# EAGLE design wtw-v01-00 (EAGLE 7.4.0)
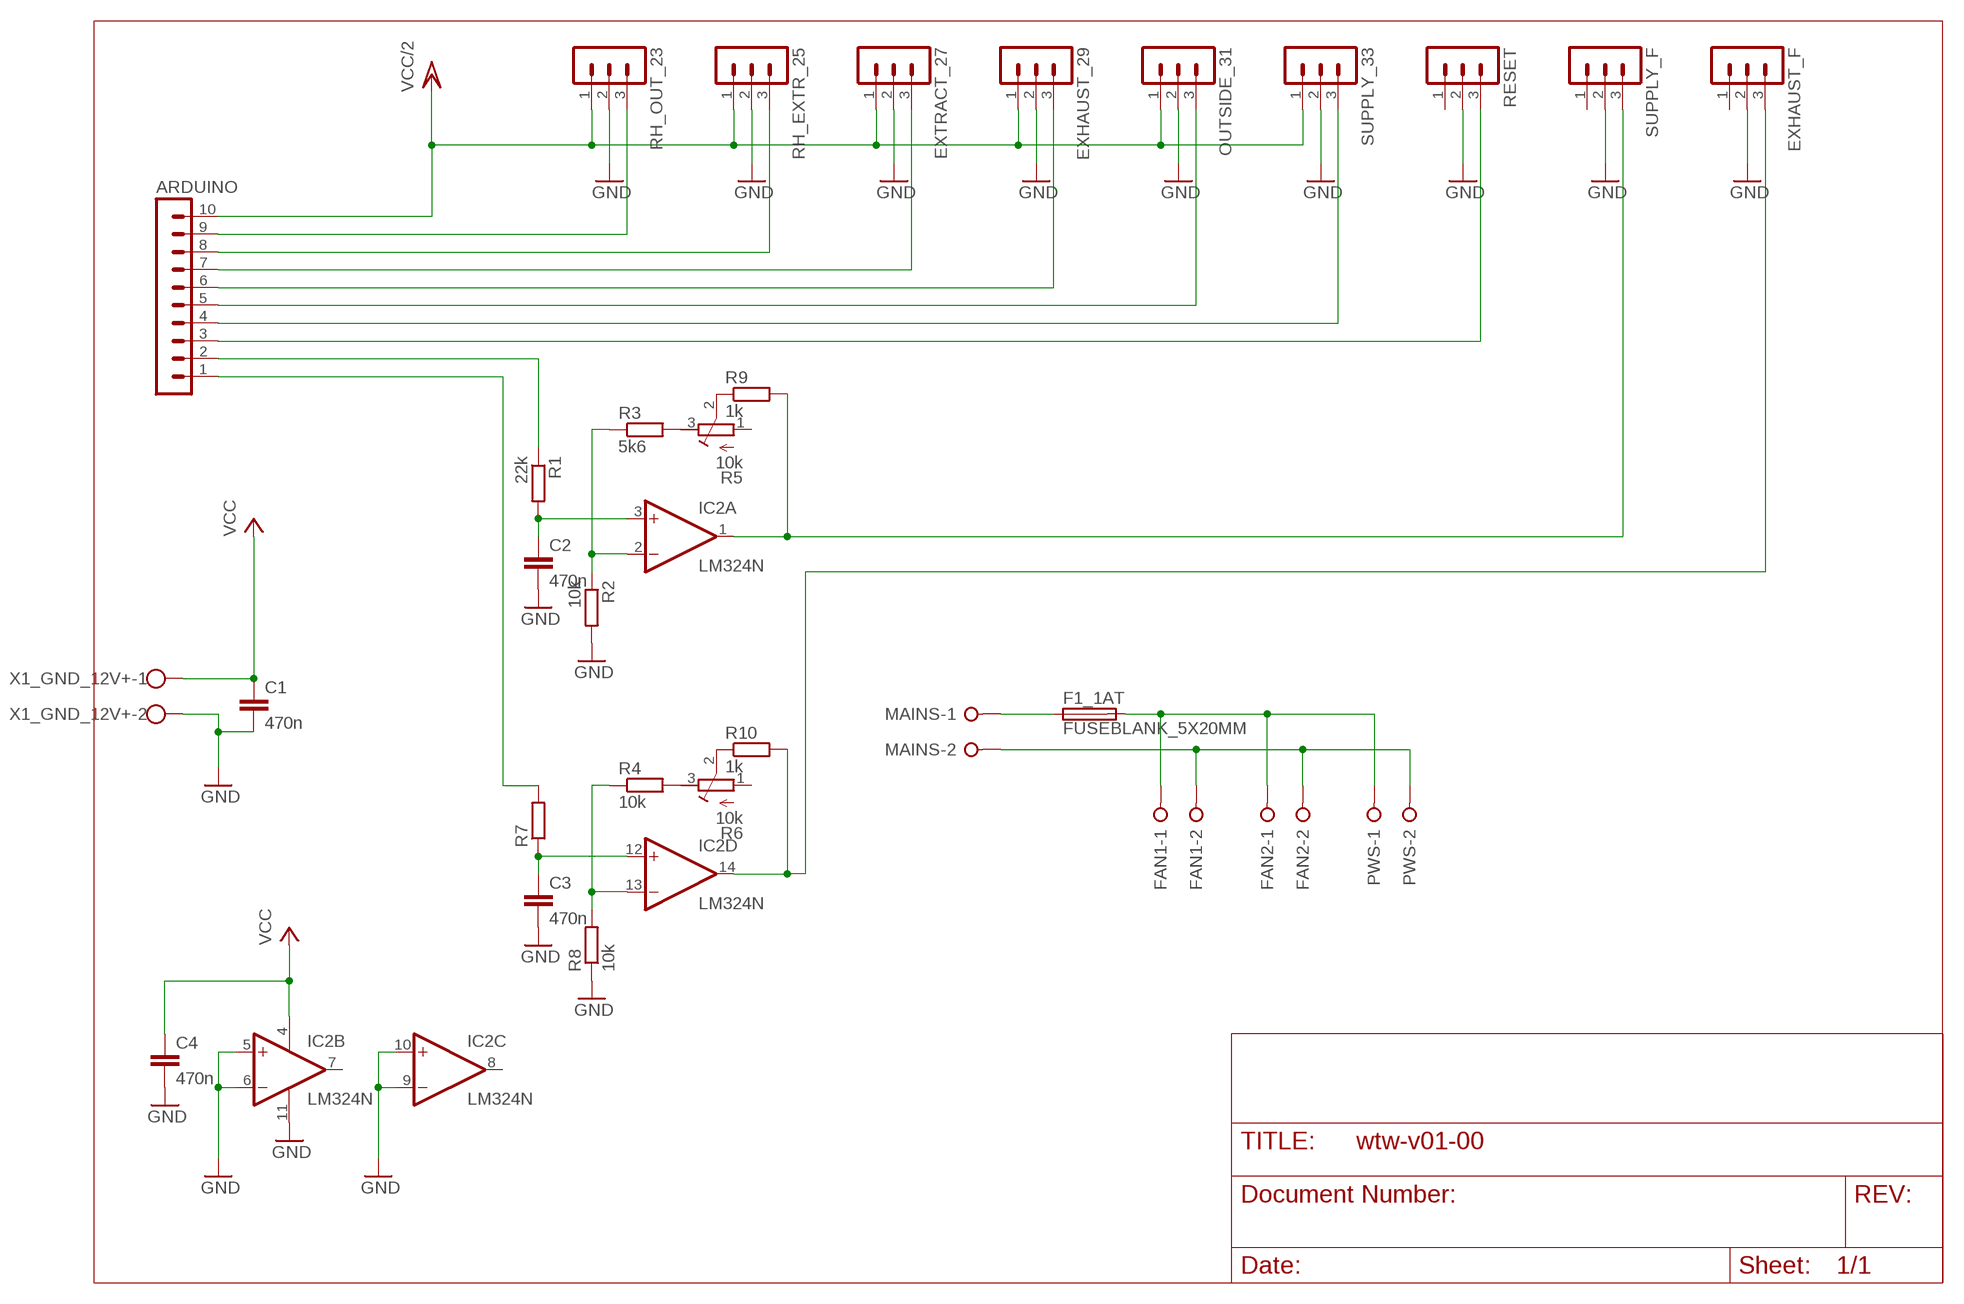
[diagram p0: schematic, sheet 1]

## Parts
ARDUINO  MA10-1  [MA10-1]
C1  470n  C-EU050-030X075  [C050-030X075]
C2  470n  C-EU050-030X075  [C050-030X075]
C3  470n  C-EU050-030X075  [C050-030X075]
C4  470n  C-EU050-030X075  [C050-030X075]
EXHAUST_29  MA03-1  [MA03-1]
EXHAUST_F  MA03-1  [MA03-1]
EXTRACT_27  MA03-1  [MA03-1]
F1_1AT  FUSEBLANK_5X20MM  [FUSE_HOLDER_5X20MM]
FAN1  W237-02P  [W237-132]
FAN2  W237-02P  [W237-132]
IC2  LM324N  [DIL14]
MAINS  W237-02P  [W237-132]
OUTSIDE_31  MA03-1  [MA03-1]
PWS  W237-02P  [W237-132]
R1  22k  R-EU_V234/12  [V234/12]
R2  10k  R-EU_V234/12  [V234/12]
R3  5k6  R-EU_V234/12  [V234/12]
R4  10k  R-EU_V234/12  [V234/12]
R5  10k  R-TRIMM64W  [RTRIM64W]
R6  10k  R-TRIMM64W  [RTRIM64W]
R7  R-EU_V234/12  [V234/12]
R8  10k  R-EU_V234/12  [V234/12]
R9  1k  R-EU_V234/12  [V234/12]
R10  1k  R-EU_V234/12  [V234/12]
RESET  MA03-1  [MA03-1]
RH_EXTR_25  MA03-1  [MA03-1]
RH_OUT_23  MA03-1  [MA03-1]
SUPPLY_33  MA03-1  [MA03-1]
SUPPLY_F  MA03-1  [MA03-1]
X1_GND_12V+  W237-4  [W237-4]

## Nets
GND: C1.2 C2.2 C3.2 C4.2 EXHAUST_29.2 EXHAUST_F.2 EXTRACT_27.2 IC2.5(B:+IN) IC2.6(B:-IN) IC2.9(C:-IN) IC2.10(C:+IN) IC2.11(P:V-) OUTSIDE_31.2 R2.2 R8.1 RESET.2 RH_EXTR_25.2 RH_OUT_23.2 SUPPLY_33.2 SUPPLY_F.2 X1_GND_12V+.2
N$1: R3.2 R5.3(E)
N$2: R4.2 R6.3(E)
N$3: ARDUINO.2 R1.1
N$4: ARDUINO.1 R7.2
N$5: C2.1 IC2.3(A:+IN) R1.2
N$6: C3.1 IC2.12(D:+IN) R7.1
N$7: IC2.2(A:-IN) R2.1 R3.1
N$8: IC2.13(D:-IN) R4.1 R8.2
N$9: ARDUINO.9 RH_OUT_23.3
N$10: ARDUINO.8 RH_EXTR_25.3
N$11: ARDUINO.7 EXTRACT_27.3
N$12: ARDUINO.6 EXHAUST_29.3
N$13: ARDUINO.5 OUTSIDE_31.3
N$14: ARDUINO.4 SUPPLY_33.3
N$15: ARDUINO.3 RESET.3
N$16: IC2.1(A:OUT) R9.2 SUPPLY_F.3
N$17: EXHAUST_F.3 IC2.14(D:OUT) R10.2
N$18: R5.2(S) R9.1
N$19: R6.2(S) R10.1
N$20: F1_1AT.1 MAINS.1
N$21: F1_1AT.2 FAN1.1 FAN2.1 PWS.1
N$22: FAN1.2 FAN2.2 MAINS.2 PWS.2
VCC: C1.1 C4.1 IC2.4(P:V+) X1_GND_12V+.1
VCC/2: ARDUINO.10 EXHAUST_29.1 EXTRACT_27.1 OUTSIDE_31.1 RH_EXTR_25.1 RH_OUT_23.1 SUPPLY_33.1
Unconnected: EXHAUST_F.1 IC2.7(B:OUT) IC2.8(C:OUT) R5.1(A) R6.1(A) RESET.1 SUPPLY_F.1 X1_GND_12V+.3 X1_GND_12V+.4

## Library data of the parts
ARDUINO = con-lstb:MA10-1: PIN HEADER; OC_FARNELL: unknown; OC_NEWARK: unknown
C1-C4 = rcl:C-EU: CAPACITOR, European symbol
EXHAUST_29 EXHAUST_F EXTRACT_27 OUTSIDE_31 RESET RH_EXTR_25 RH_OUT_23 SUPPLY_33 SUPPLY_F = con-lstb:MA03-1: PIN HEADER; OC_FARNELL: unknown; OC_NEWARK: unknown
F1_1AT = fuse:FUSE: Fuse; OC_FARNELL: unknown; OC_NEWARK: unknown
FAN1 FAN2 MAINS PWS = con-wago-508:W237-02P: WAGO SREW CLAMP; OC_FARNELL: unknown; OC_NEWARK: unknown
IC2 = linear4:LM324: OP AMP
R1-R4 R7-R10 = resistor:R-EU_: RESISTOR, European symbol
R5 R6 = resistor:R-TRIMM: Trimm resistor
X1_GND_12V+ = con-wago-500:W237-4: WAGO SCREW CLAMP; OC_FARNELL: unknown; OC_NEWARK: unknown

## Net classes
0 default: width 0.61 mm, drill 0.406 mm, clearance 0.406 mm

## Board
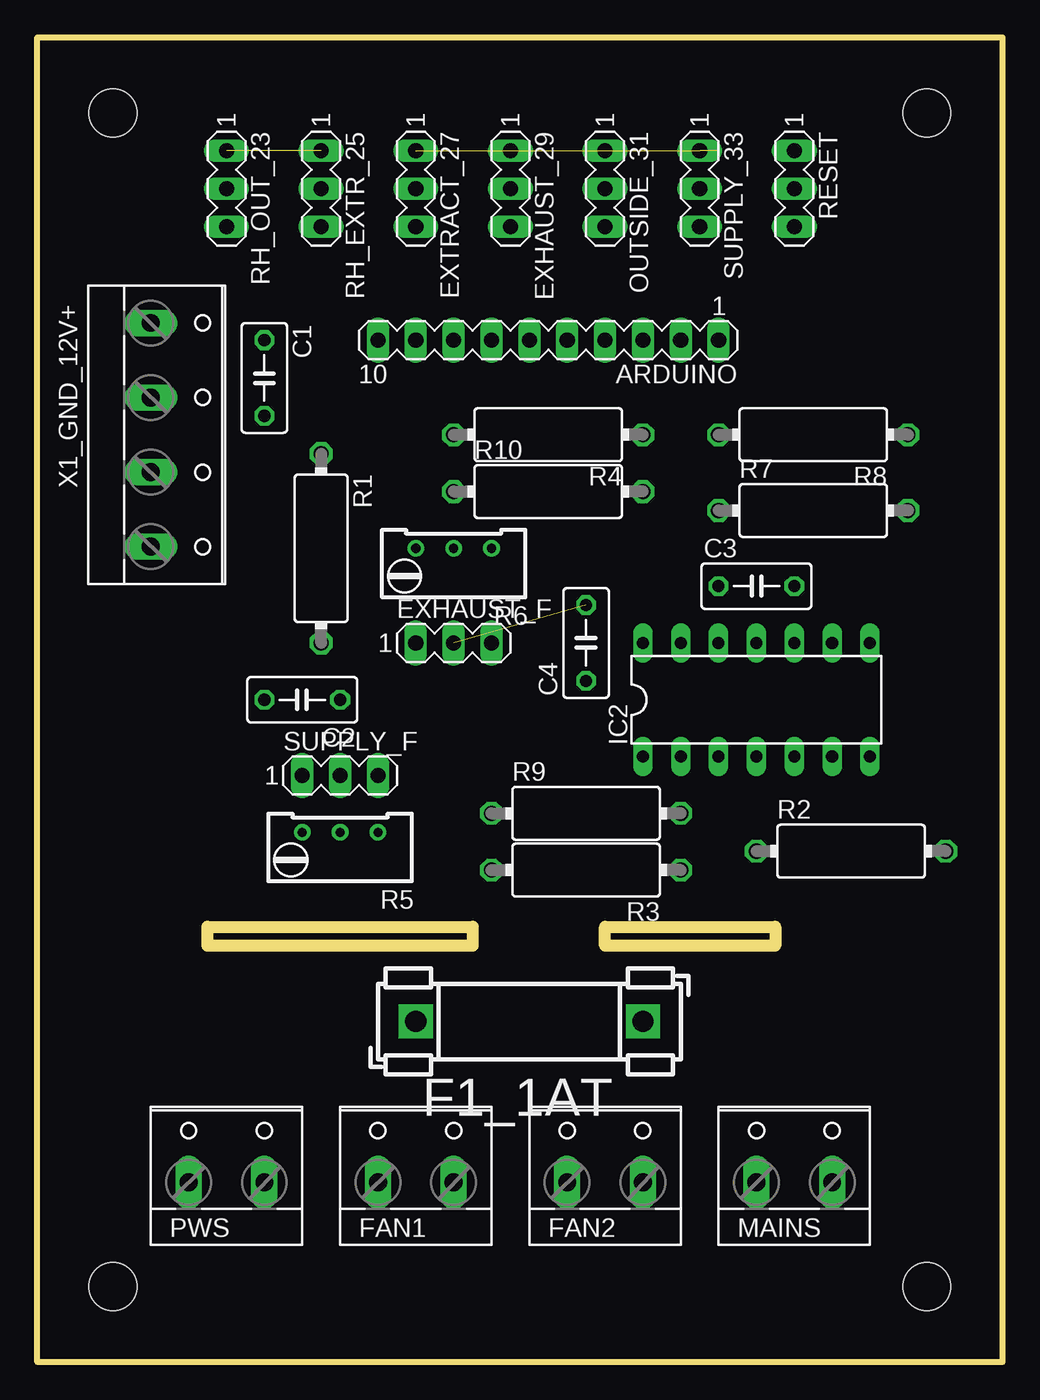
[diagram p1: board, top side]
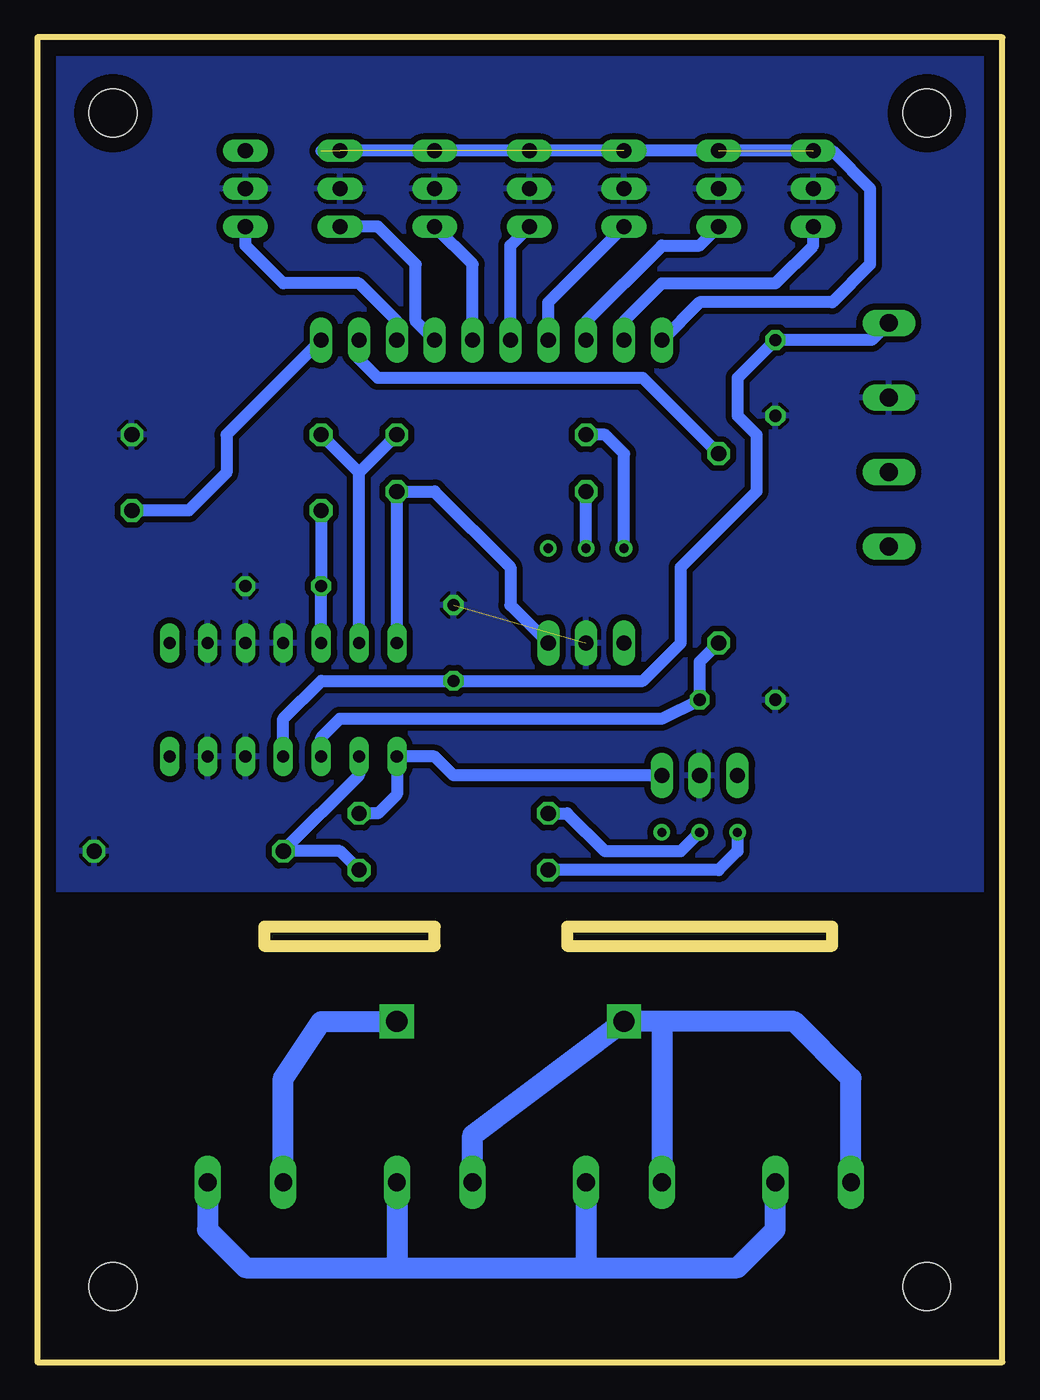
[diagram p2: board, bottom side, seen from below]

Size 64.77 x 88.9 mm. Coordinates in mm from the lower left corner, seen from the top.
Outline: 0,88.9 64.77,88.9 64.77,0 0,0 0,88.9
Copper layers (1*16): Top 0.035mm / dielectric 1.5mm / Bottom 0.035mm
Design rules "default *": minimum track width 12mil, minimum drill 24mil, track to track 10mil, track to pad 10mil, pad to pad 10mil, via to via 10mil, smd to smd 10mil, copper to edge 40mil, drill to drill 10mil, minimum pad ring 10mil, minimum via ring 8mil, stop-mask expansion 4mil, vias tented up to drill 0mil, thermal gap 10mil
Holes 3.2 mm at 5.08,83.82 59.69,83.82 5.08,5.08 59.69,5.08

### Footprints (pad centres in the part's own frame; a part is rotated, then mirrored left to right if it is on the bottom)
MA10-1 = drill 1.016 long: 1 -11.43,0; 2 -8.89,0; 3 -6.35,0; 4 -3.81,0; 5 -1.27,0; 6 1.27,0; 7 3.81,0; 8 6.35,0; 9 8.89,0; 10 11.43,0
C050-030X075 = drill 0.813 octagon: 1 -2.54,0; 2 2.54,0
MA03-1 = drill 1.016 long: 1 -2.54,0; 2 0,0; 3 2.54,0
FUSE_HOLDER_5X20MM = drill 1.422 pad 2.286 square: 1 0,0; 2 15.24,0
W237-132 = drill 1.194 long: 1 -2.54,-0.635; 2 2.54,-0.635
DIL14 = drill 0.813 long: 1 -7.62,-3.81; 2 -5.08,-3.81; 3 -2.54,-3.81; 4 0,-3.81; 5 2.54,-3.81; 6 5.08,-3.81; 7 7.62,-3.81; 8 7.62,3.81; 9 5.08,3.81; 10 2.54,3.81; 11 0,3.81; 12 -2.54,3.81; 13 -5.08,3.81; 14 -7.62,3.81
V234/12 = drill 1.016 octagon: 1 -6.35,0; 2 6.35,0
RTRIM64W = drill 0.61: 1 1.27,-2.54; 2 1.27,0; 3 1.27,2.54
W237-4 = drill 1.194 long: 1 -7.5,-1.27; 2 -2.5,-1.27; 3 2.5,-1.27; 4 7.5,-1.27

### Placement (x,y rotation side)
ARDUINO  34.29,68.58 180 top
C1  15.24,66.04 270 top
C2  17.78,44.45 180 top
C3  48.26,52.07 0 top
C4  36.83,48.26 90 top
EXHAUST_29  31.75,78.74 270 top
EXHAUST_F  27.94,48.26 0 top
EXTRACT_27  25.4,78.74 270 top
F1_1AT  40.64,22.86 180 top
FAN1  25.4,12.7 0 top
FAN2  38.1,12.7 0 top
IC2  48.26,44.45 0 top
MAINS  50.8,12.7 0 top
OUTSIDE_31  38.1,78.74 270 top
PWS  12.7,12.7 0 top
R1  19.05,54.61 270 top
R2  54.61,34.29 0 top
R3  36.83,33.02 180 top
R4  34.29,62.23 180 top
R5  20.32,34.29 90 top
R6  27.94,53.34 90 top
R7  52.07,57.15 0 top
R8  52.07,62.23 180 top
R9  36.83,36.83 0 top
R10  34.29,58.42 0 top
RESET  50.8,78.74 270 top
RH_EXTR_25  19.05,78.74 270 top
RH_OUT_23  12.7,78.74 270 top
SUPPLY_33  44.45,78.74 270 top
SUPPLY_F  20.32,39.37 0 top
X1_GND_12V+  8.89,62.23 270 top

### Tracks (layer width: path | path; a pad name or v marks a point on that pad's centre or on a via)
GND  (1 unrouted)
  pour Bottom (isolate 0.406): 1.27,87.63 63.5,87.63 63.5,31.75 1.27,31.75
N$1
  Bottom 0.813: R5.3 17.78,34.29 19.05,33.02 R3.2
N$2
  Bottom 0.813: R4.2 26.67,62.23 25.4,60.96 R6.3
N$3
  Bottom 0.813: R1.1 24.13,66.04 41.91,66.04 43.18,67.31 ARDUINO.2
N$4
  Bottom 0.813: ARDUINO.1 52.07,62.23 52.07,59.69 54.61,57.15 R7.2
N$5
  Bottom 0.813: IC2.3 45.72,41.91 44.45,43.18 22.86,43.18 C2.1 20.32,46.99 R1.2
N$6
  Bottom 0.813: IC2.12 C3.1 R7.1
N$7
  Bottom 0.813: R3.1 44.45,34.29 R2.1 43.18,39.37 IC2.2
N$8
  Bottom 0.813: IC2.13 43.18,59.69 | 43.18,59.69 R4.1 | R8.2 43.18,59.69
N$9
  Bottom 0.813: ARDUINO.9 25.4,69.85 22.86,72.39 15.24,72.39 12.7,74.93 RH_OUT_23.3
N$10
  Bottom 0.813: ARDUINO.8 27.94,69.85 22.86,74.93 20.32,74.93 RH_EXTR_25.3
N$11
  Bottom 0.813: ARDUINO.7 30.48,71.12 EXTRACT_27.3
N$12
  Bottom 0.813: ARDUINO.6 33.02,74.93 EXHAUST_29.3
N$13
  Bottom 0.813: ARDUINO.5 35.56,73.66 OUTSIDE_31.3
N$14
  Bottom 0.813: ARDUINO.4 39.37,69.85 39.37,73.66 41.91,76.2 SUPPLY_33.3
N$15
  Bottom 0.813: ARDUINO.3 40.64,69.85 43.18,72.39 48.26,72.39 50.8,74.93 RESET.3
N$16
  Bottom 0.813: SUPPLY_F.3 36.83,39.37 38.1,40.64 IC2.1 40.64,38.1 41.91,36.83 R9.2
N$17
  Bottom 0.813: EXHAUST_F.3 33.02,50.8 33.02,53.34 38.1,58.42 R10.2 IC2.14
N$18
  Bottom 0.813: R9.1 29.21,36.83 26.67,34.29 21.59,34.29 R5.2
N$19
  Bottom 0.813: R6.2 R10.1
N$20
  Bottom 1.422: MAINS.1 48.26,19.05 45.72,22.86 F1_1AT.1
N$21
  Bottom 1.422: 22.86,22.86 FAN1.1 | FAN2.1 35.56,15.24 F1_1AT.2 22.86,22.86 | PWS.1 10.16,19.05 13.97,22.86 22.86,22.86
N$22
  Bottom 1.422: 40.64,6.35 27.94,6.35 | 27.94,6.35 17.78,6.35 15.24,8.89 PWS.2 | FAN1.2 27.94,6.35 | FAN2.2 40.64,6.35 | MAINS.2 53.34,8.89 50.8,6.35 40.64,6.35
VCC
  Bottom 0.813: IC2.4 48.26,43.18 45.72,45.72 C4.1 24.13,45.72 21.59,48.26 21.59,53.34 16.51,58.42 16.51,62.23 17.78,63.5 17.78,66.04 C1.1 8.77,68.58 X1_GND_12V+.1
VCC/2  (5 unrouted)
  Bottom 0.813: 45.72,81.28 RH_OUT_23.1 11.43,81.28 8.89,78.74 8.89,73.66 11.43,71.12 20.32,71.12 ARDUINO.10